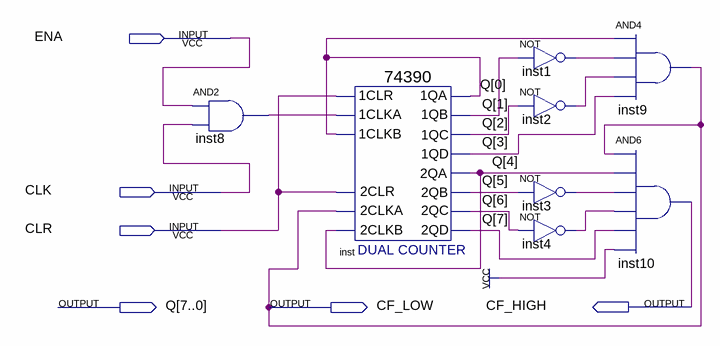
[diagram p0: schematic sheet]
// Quartus schematic COUNTER.bdf as structural Verilog: 8 symbols, 6 pins
module COUNTER (
  input  ENA,
  input  CLK,
  input  CLR,
  output [7:0] Q,
  output CF_LOW,
  output CF_HIGH
);

  wire inst1_out, inst2_out, inst3_out, inst4_out, inst8_out;

  and inst8 (inst8_out, ENA, CLK);
  \74390  inst (
    .\2CLKA (CF_LOW), .\2CLR (CLR), .\2CLKB (Q[4]), .\1CLR (CLR), .\1CLKA (inst8_out), .\1CLKB (Q[0]),
    .\1QA (Q[0]), .\1QB (Q[1]), .\1QC (Q[2]), .\1QD (Q[3]), .\2QA (Q[4]), .\2QB (Q[5]), .\2QC (Q[6]),
    .\2QD (Q[7]));
  not inst1 (inst1_out, Q[1]);
  not inst2 (inst2_out, Q[2]);
  not inst3 (inst3_out, Q[5]);
  not inst4 (inst4_out, Q[6]);
  and inst9 (CF_LOW, Q[0], inst1_out, inst2_out, Q[3]);
  and inst10 (CF_HIGH, CF_LOW, Q[4], inst3_out, inst4_out, Q[7], 1'b1);
endmodule
